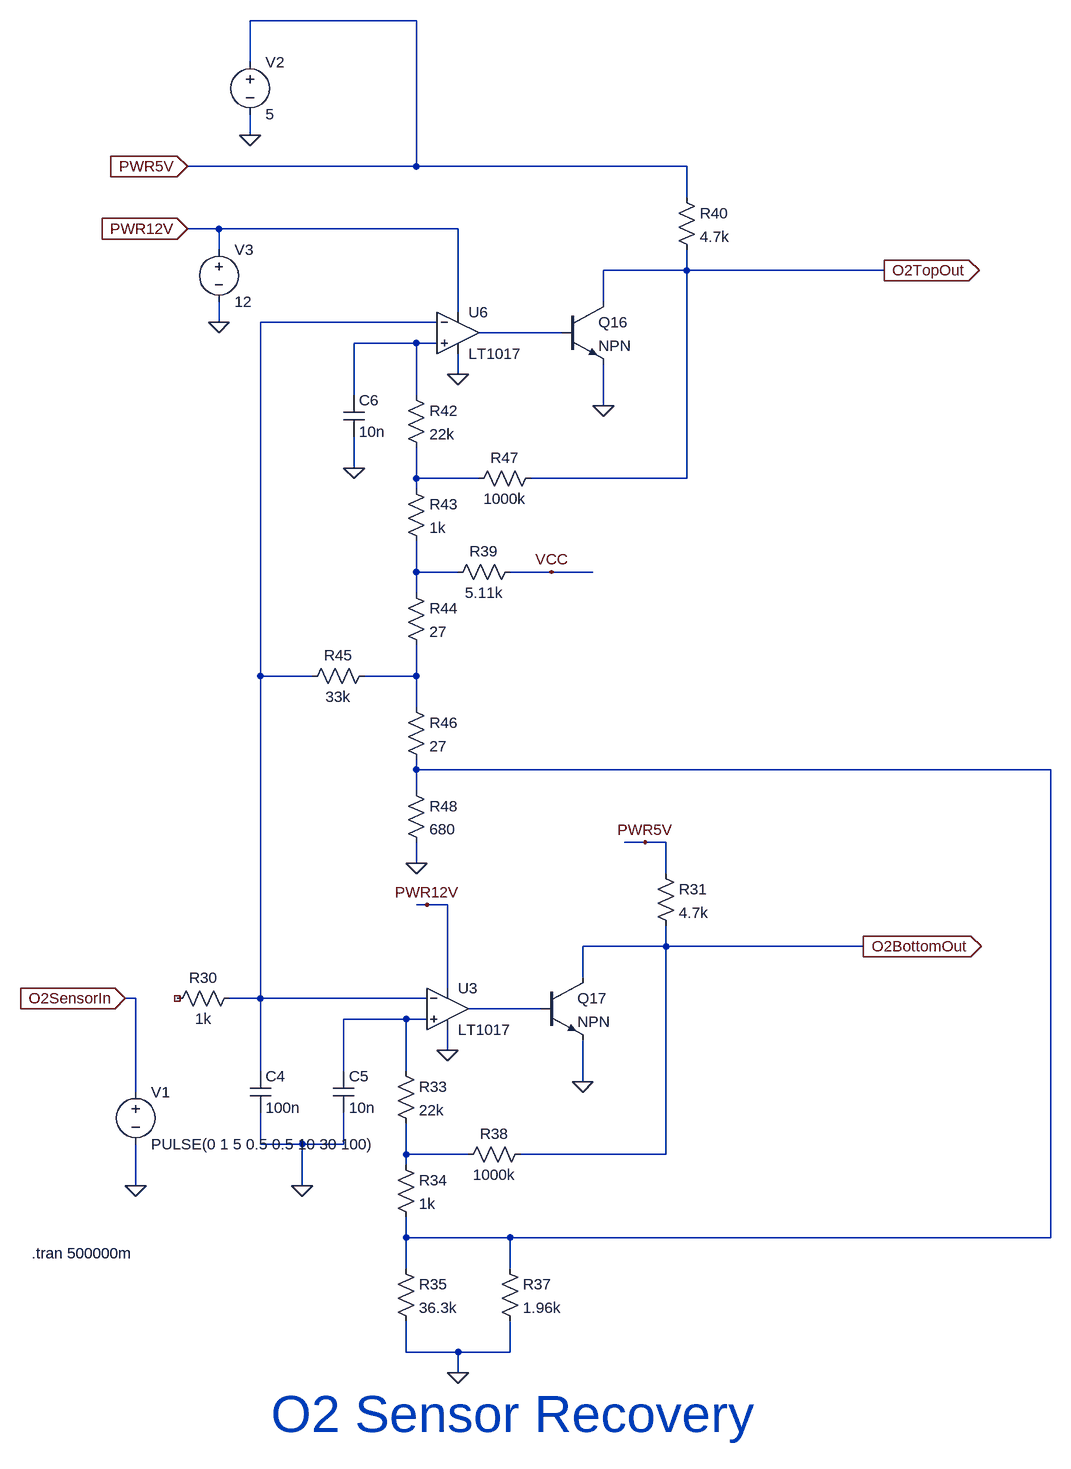
[diagram p0: schematic dme_analog_O2_recovery_test.asc]
dme_analog_O2_recovery_test.asc, the LTspice schematic file:
Version 4
SHEET 1 4356 3824
WIRE -192 -3056 -448 -3056
WIRE -448 -2992 -448 -3056
WIRE -448 -2880 -448 -2912
WIRE -192 -2832 -192 -3056
WIRE -192 -2832 -544 -2832
WIRE 224 -2832 -192 -2832
WIRE 224 -2784 224 -2832
WIRE -496 -2736 -544 -2736
WIRE -128 -2736 -496 -2736
WIRE -496 -2704 -496 -2736
WIRE 224 -2672 224 -2704
WIRE 224 -2672 96 -2672
WIRE 528 -2672 224 -2672
WIRE 96 -2624 96 -2672
WIRE -128 -2608 -128 -2736
WIRE -496 -2592 -496 -2624
WIRE -160 -2592 -432 -2592
WIRE 32 -2576 -96 -2576
WIRE -192 -2560 -288 -2560
WIRE -160 -2560 -192 -2560
WIRE -128 -2512 -128 -2544
WIRE -288 -2480 -288 -2560
WIRE -192 -2480 -192 -2560
WIRE 96 -2464 96 -2528
WIRE -288 -2368 -288 -2416
WIRE -192 -2352 -192 -2400
WIRE -96 -2352 -192 -2352
WIRE 224 -2352 224 -2672
WIRE 224 -2352 -16 -2352
WIRE -192 -2336 -192 -2352
WIRE -192 -2208 -192 -2256
WIRE -128 -2208 -192 -2208
WIRE 16 -2208 -48 -2208
WIRE 80 -2208 16 -2208
WIRE -192 -2176 -192 -2208
WIRE -432 -2048 -432 -2592
WIRE -352 -2048 -432 -2048
WIRE -192 -2048 -192 -2096
WIRE -192 -2048 -272 -2048
WIRE -192 -2000 -192 -2048
WIRE -192 -1904 -192 -1920
WIRE 784 -1904 -192 -1904
WIRE -192 -1872 -192 -1904
WIRE 160 -1792 128 -1792
WIRE 192 -1792 160 -1792
WIRE -192 -1760 -192 -1792
WIRE 192 -1744 192 -1792
WIRE -176 -1696 -192 -1696
WIRE -144 -1696 -176 -1696
WIRE 192 -1632 192 -1664
WIRE 192 -1632 64 -1632
WIRE 496 -1632 192 -1632
WIRE 64 -1584 64 -1632
WIRE -144 -1568 -144 -1696
WIRE -624 -1552 -640 -1552
WIRE -432 -1552 -432 -2048
WIRE -432 -1552 -480 -1552
WIRE -176 -1552 -432 -1552
WIRE 0 -1536 -112 -1536
WIRE -208 -1520 -304 -1520
WIRE -176 -1520 -208 -1520
WIRE -144 -1472 -144 -1504
WIRE -432 -1440 -432 -1552
WIRE -304 -1440 -304 -1520
WIRE -208 -1440 -208 -1520
WIRE 64 -1424 64 -1488
WIRE -624 -1408 -624 -1552
WIRE -432 -1328 -432 -1376
WIRE -368 -1328 -432 -1328
WIRE -304 -1328 -304 -1376
WIRE -304 -1328 -368 -1328
WIRE -208 -1312 -208 -1360
WIRE -112 -1312 -208 -1312
WIRE 192 -1312 192 -1632
WIRE 192 -1312 -32 -1312
WIRE -208 -1296 -208 -1312
WIRE -624 -1264 -624 -1328
WIRE -368 -1264 -368 -1328
WIRE -208 -1184 -208 -1216
WIRE -48 -1184 -208 -1184
WIRE 784 -1184 784 -1904
WIRE 784 -1184 -48 -1184
WIRE -208 -1136 -208 -1184
WIRE -48 -1136 -48 -1184
WIRE -208 -1008 -208 -1056
WIRE -128 -1008 -208 -1008
WIRE -48 -1008 -48 -1056
WIRE -48 -1008 -128 -1008
WIRE -128 -976 -128 -1008
FLAG -176 -1696 PWR12V
FLAG -144 -1472 0
FLAG -640 -1552 O2SensorIn
IOPIN -640 -1552 In
FLAG -368 -1264 0
FLAG 160 -1792 PWR5V
FLAG -128 -976 0
FLAG 496 -1632 O2BottomOut
IOPIN 496 -1632 Out
FLAG -128 -2512 0
FLAG 528 -2672 O2TopOut
IOPIN 528 -2672 Out
FLAG -288 -2368 0
FLAG 16 -2208 VCC
FLAG -192 -1760 0
FLAG 96 -2464 0
FLAG 64 -1424 0
FLAG -544 -2832 PWR5V
IOPIN -544 -2832 In
FLAG -544 -2736 PWR12V
IOPIN -544 -2736 In
FLAG -624 -1264 0
FLAG -496 -2592 0
FLAG -448 -2880 0
SYMBOL res -464 -1568 R90
WINDOW 0 0 56 VBottom 2
WINDOW 3 32 56 VTop 2
SYMATTR InstName R30
SYMATTR Value 1k
SYMBOL Res 176 -1760 R0
SYMATTR InstName R31
SYMATTR Value 4.7k
SYMBOL Cap -448 -1440 R0
SYMATTR InstName C4
SYMATTR Value 100n
SYMBOL Cap -320 -1440 R0
SYMATTR InstName C5
SYMATTR Value 10n
SYMBOL Res -224 -1456 R0
SYMATTR InstName R33
SYMATTR Value 22k
SYMBOL Res -224 -1312 R0
SYMATTR InstName R34
SYMATTR Value 1k
SYMBOL Res -224 -1152 R0
SYMATTR InstName R35
SYMATTR Value 36.3k
SYMBOL Res -64 -1152 R0
SYMATTR InstName R37
SYMATTR Value 1.96k
SYMBOL Res -16 -1328 R90
WINDOW 0 0 56 VBottom 2
WINDOW 3 32 56 VTop 2
SYMATTR InstName R38
SYMATTR Value 1000k
SYMBOL Res 208 -2800 R0
SYMATTR InstName R40
SYMATTR Value 4.7k
SYMBOL Cap -304 -2480 R0
SYMATTR InstName C6
SYMATTR Value 10n
SYMBOL Res -208 -2496 R0
SYMATTR InstName R42
SYMATTR Value 22k
SYMBOL Res -208 -2352 R0
SYMATTR InstName R43
SYMATTR Value 1k
SYMBOL Res -208 -2192 R0
SYMATTR InstName R44
SYMATTR Value 27
SYMBOL Res 0 -2368 R90
WINDOW 0 0 56 VBottom 2
WINDOW 3 32 56 VTop 2
SYMATTR InstName R47
SYMATTR Value 1000k
SYMBOL Res -32 -2224 R90
WINDOW 0 0 56 VBottom 2
WINDOW 3 32 56 VTop 2
SYMATTR InstName R39
SYMATTR Value 5.11k
SYMBOL Res -256 -2064 R90
WINDOW 0 0 56 VBottom 2
WINDOW 3 32 56 VTop 2
SYMATTR InstName R45
SYMATTR Value 33k
SYMBOL Res -208 -2016 R0
SYMATTR InstName R46
SYMATTR Value 27
SYMBOL Res -208 -1888 R0
SYMATTR InstName R48
SYMATTR Value 680
SYMBOL Comparators/LT1017 -128 -2576 R0
SYMATTR InstName U6
SYMBOL npn 32 -2624 R0
SYMATTR InstName Q16
SYMBOL npn 0 -1584 R0
SYMATTR InstName Q17
SYMBOL Comparators/LT1017 -144 -1536 R0
SYMATTR InstName U3
SYMBOL voltage -624 -1424 R0
SYMATTR InstName V1
SYMATTR Value PULSE(0 1 5 0.5 0.5 10 30 100)
SYMBOL voltage -448 -3008 R0
SYMATTR InstName V2
SYMATTR Value 5
SYMBOL voltage -496 -2720 R0
SYMATTR InstName V3
SYMATTR Value 12
TEXT -416 -912 Left 6 ;O2 Sensor Recovery
TEXT -784 -1160 Left 2 !.tran 500000m

The netlist it stands for:
* dme_analog_O2_recovery_test.asc
R30 N001 NC_01 1k
R31 PWR5V O2BottomOut 4.7k
C4 N001 0 100n
C5 N009 0 10n
R33 N009 N010 22k
R34 N010 N007 1k
R35 N007 0 36.3k
R37 N007 0 1.96k
R38 O2BottomOut N010 1000k
R40 PWR5V O2TopOut 4.7k
C6 N003 0 10n
R42 N003 N004 22k
R43 N004 N005 1k
R44 N005 N006 27
R47 O2TopOut N004 1000k
R39 VCC N005 5.11k
R45 N006 N001 33k
R46 N006 N007 27
R48 N007 0 680
XU6 N003 N001 PWR12V 0 N002 LT1017  ; pins In+ In- V+ V- OUT
Q16 O2TopOut N002 0 0 NPN
Q17 O2BottomOut N008 0 0 NPN
XU3 N009 N001 PWR12V 0 N008 LT1017  ; pins In+ In- V+ V- OUT
V1 O2SensorIn 0 PULSE(0 1 5 0.5 0.5 10 30 100)
V2 PWR5V 0 5
V3 PWR12V 0 12
.model NPN NPN
.model PNP PNP
.lib standard.bjt
* O2 Sensor Recovery
.tran 500000m
.backanno
.end